# Altium schematic sheet MCU_1726036.SchDoc
size A3; SheetNumber: 1; SheetTotal: 2
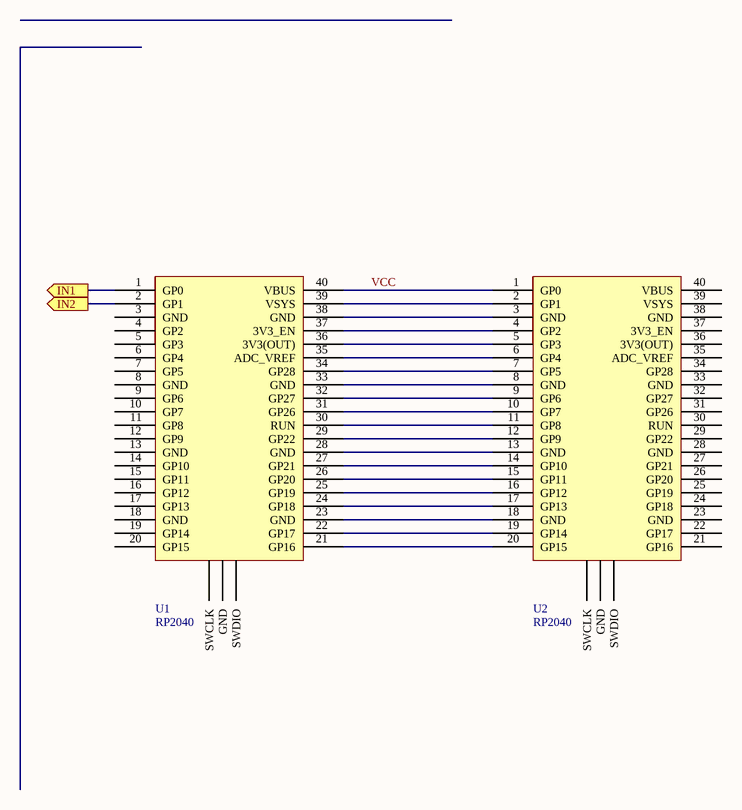
[diagram p0: MCU_1726036.SchDoc]

## Parts
U1  RP2040  [PICO_MCU]
U2  RP2040  [PICO_MCU]

## Ports
IN1 (out), IN2 (out)

## Nets
IN1: U1.1(GP0) ; port IN1
IN2: U1.2(GP1) ; port IN2
VCC: U1.40(VBUS) U2.1(GP0)
NetU1_21: U1.21(GP16) U2.20(GP15)
NetU1_22: U1.22(GP17) U2.19(GP14)
NetU1_23: U1.23(GND) U2.18(GND)
NetU1_24: U1.24(GP18) U2.17(GP13)
NetU1_25: U1.25(GP19) U2.16(GP12)
NetU1_26: U1.26(GP20) U2.15(GP11)
NetU1_27: U1.27(GP21) U2.14(GP10)
NetU1_28: U1.28(GND) U2.13(GND)
NetU1_29: U1.29(GP22) U2.12(GP9)
NetU1_30: U1.30(RUN) U2.11(GP8)
NetU1_31: U1.31(GP26) U2.10(GP7)
NetU1_32: U1.32(GP27) U2.9(GP6)
NetU1_33: U1.33(GND) U2.8(GND)
NetU1_34: U1.34(GP28) U2.7(GP5)
NetU1_35: U1.35(ADC_VREF) U2.6(GP4)
NetU1_36: U1.36(3V3(OUT)) U2.5(GP3)
NetU1_37: U1.37(3V3_EN) U2.4(GP2)
NetU1_38: U1.38(GND) U2.3(GND)
NetU1_39: U1.39(VSYS) U2.2(GP1)

Not connected (* = marked no-connect by the designer): U1 3(GND) 4(GP2) 5(GP3) 6(GP4) 7(GP5) 8(GND) 9(GP6) 10(GP7) 11(GP8) 12(GP9) 13(GND) 14(GP10) 15(GP11) 16(GP12) 17(GP13) 18(GND) 19(GP14) 20(GP15) ?1(SWCLK) ?2(GND) ?3(SWDIO); U2 21(GP16) 22(GP17) 23(GND) 24(GP18) 25(GP19) 26(GP20) 27(GP21) 28(GND) 29(GP22) 30(RUN) 31(GP26) 32(GP27) 33(GND) 34(GP28) 35(ADC_VREF) 36(3V3(OUT)) 37(3V3_EN) 38(GND) 39(VSYS) 40(VBUS) ?1(SWCLK) ?2(GND) ?3(SWDIO)

## Library data of the parts
U1 U2 = PICO_MCU